# EAGLE design v13 (EAGLE 7.2.0)
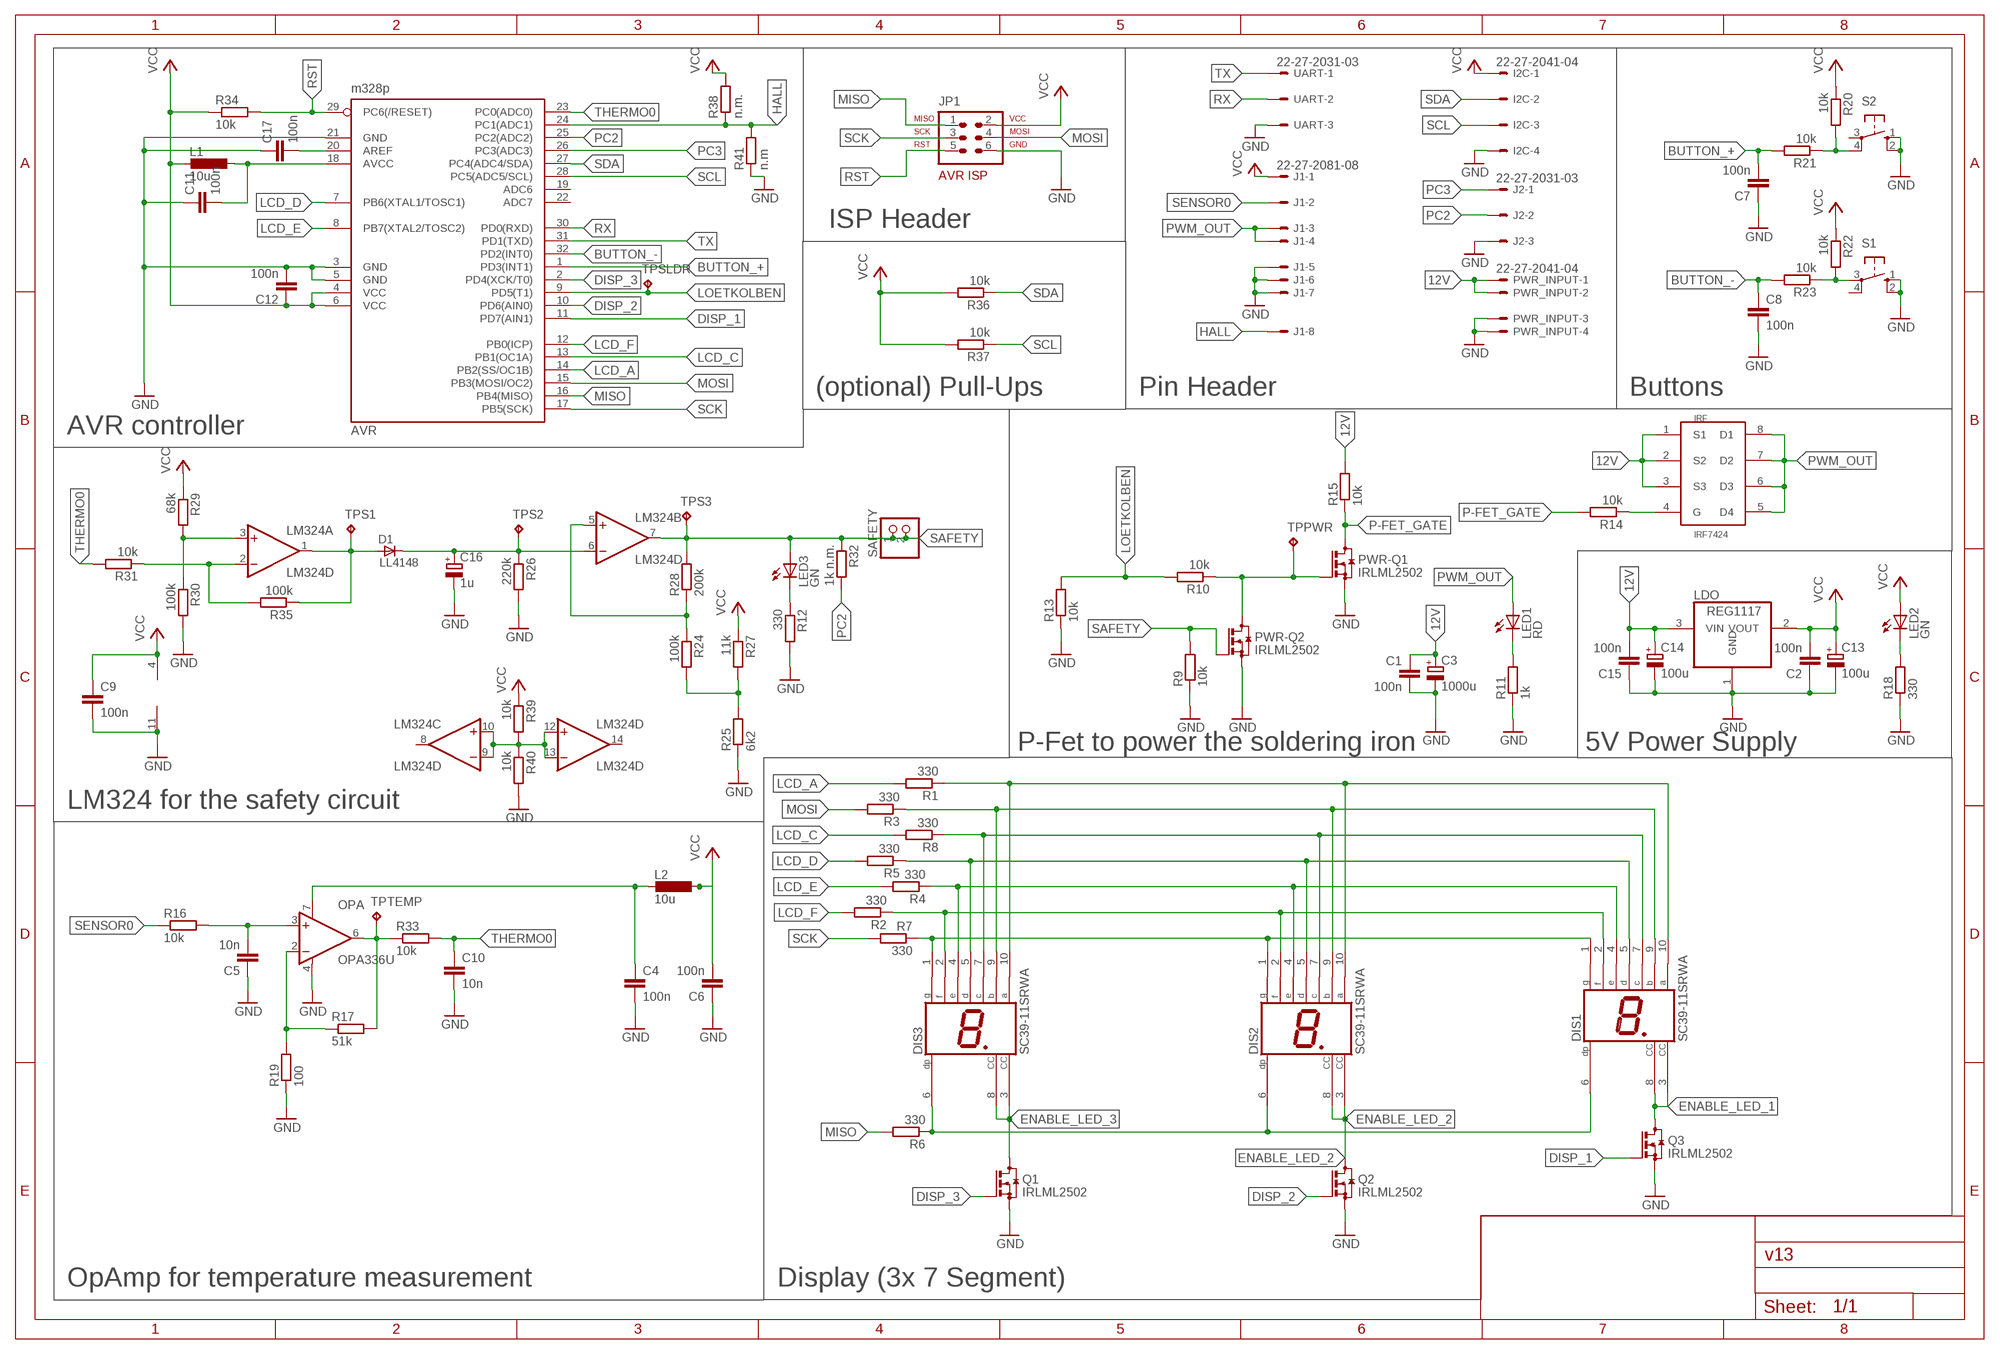
[diagram p0: schematic, sheet 1]

## Parts
AVR  m328p  MEGA8-AI  [TQFP32-08]
C1  100n  C-EUC0603  [C0603]
C2  100n  C-EUC0603  [C0603]
C3  1000u  CPOL-EUE5-13  [E5-13]
C4  100n  C-EUC0603  [C0603]
C5  10n  C-EUC0603  [C0603]
C6  100n  C-EUC0603  [C0603]
C7  100n  C-EUC0603  [C0603]
C8  100n  C-EUC0603  [C0603]
C9  100n  C-EUC0603  [C0603]
C10  10n  C-EUC0603  [C0603]
C11  100n  C-EUC0603  [C0603]
C12  100n  C-EUC0603  [C0603]
C13  100u  CPOL-EUE2-5  [E2-5]
C14  100u  CPOL-EUE2-5  [E2-5]
C15  100n  C-EUC0603  [C0603]
C16  1u  CPOL-EUE2-5  [E2-5]
C17  100n  C-EUC0603  [C0603]
D1  LL4148  [SOD80_DO213AA_MINIMELF]
DIS1  SC39-11SRWA  [HDSP-E]
DIS2  SC39-11SRWA  [HDSP-E]
DIS3  SC39-11SRWA  [HDSP-E]
I2C  22-27-2041-04  [6410-04]
IRF  IRF7424  [SO-08]
J1  22-27-2081-08  [6410-08]
J2  22-27-2031-03  [6410-03]
JP1  AVR-ISP-6VERT  [AVR-ISP-6]
L1  10u  L-EUL2825P  [L2825P]
L2  10u  L-EUL2825P  [L2825P]
LDO  REG1117  [SOT223]
LED1  RD  LEDCHIP-LED0805  [CHIP-LED0805]
LED2  GN  LEDCHIP-LED0805  [CHIP-LED0805]
LED3  GN  LEDCHIP-LED0805  [CHIP-LED0805]
LM324  LM324D  [SO14]
OPA  OPA336U  [SO08]
PWR-Q1  IRLML2502  BSS123  [SOT23]
PWR-Q2  IRLML2502  BSS123  [SOT23]
PWR_INPUT  22-27-2041-04  [6410-04]
Q1  IRLML2502  BSS123  [SOT23]
Q2  IRLML2502  BSS123  [SOT23]
Q3  IRLML2502  BSS123  [SOT23]
R1  330  R-EU_R0603  [R0603]
R2  330  R-EU_R0603  [R0603]
R3  330  R-EU_R0603  [R0603]
R4  330  R-EU_R0603  [R0603]
R5  330  R-EU_R0603  [R0603]
R6  330  R-EU_R0603  [R0603]
R7  330  R-EU_R0603  [R0603]
R8  330  R-EU_R0603  [R0603]
R9  10k  R-EU_R0603  [R0603]
R10  10k  R-EU_R0603  [R0603]
R11  1k  R-EU_R0603  [R0603]
R12  330  R-EU_R0603  [R0603]
R13  10k  R-EU_R0603  [R0603]
R14  10k  R-EU_R0603  [R0603]
R15  10k  R-EU_R0603  [R0603]
R16  10k  R-EU_R0603  [R0603]
R17  51k  R-EU_R0603  [R0603]
R18  330  R-EU_R0603  [R0603]
R19  100  R-EU_R0603  [R0603]
R20  10k  R-EU_R0603  [R0603]
R21  10k  R-EU_R0603  [R0603]
R22  10k  R-EU_R0603  [R0603]
R23  10k  R-EU_R0603  [R0603]
R24  100k  R-EU_R0603  [R0603]
R25  6k2  R-EU_R0603  [R0603]
R26  220k  R-EU_R0603  [R0603]
R27  11k  R-EU_R0603  [R0603]
R28  200k  R-EU_R0603  [R0603]
R29  68k  R-EU_R0603  [R0603]
R30  100k  R-EU_R0603  [R0603]
R31  10k  R-EU_R0603  [R0603]
R32  1k n.m.  R-EU_R0603  [R0603]
R33  10k  R-EU_R0603  [R0603]
R34  10k  R-EU_R0603  [R0603]
R35  100k  R-EU_R0603  [R0603]
R36  10k  R-EU_R0603  [R0603]
R37  10k  R-EU_R0603  [R0603]
R38  n.m.  R-EU_R0603  [R0603]
R39  10k  R-EU_R0603  [R0603]
R40  10k  R-EU_R0603  [R0603]
R41  n.m  R-EU_R0603  [R0603]
S1  10-XX  [B3F-10XX]
S2  10-XX  [B3F-10XX]
SAFETY  PINHD-1X2  [1X02]
TPPWR  TPB1,27  [B1,27]
TPS1  TPB1,27  [B1,27]
TPS2  TPB1,27  [B1,27]
TPS3  TPB1,27  [B1,27]
TPSLDR  TPB1,27  [B1,27]
TPTEMP  TPB1,27  [B1,27]
UART  22-27-2031-03  [6410-03]

## Nets
12V: C1.1 C3.+ C14.+ C15.2 IRF.1(S1) IRF.2(S2) IRF.3(S3) LDO.3(VIN) PWR_INPUT.1 PWR_INPUT.2 R15.2
AREF: AVR.20(AREF) C17.2
AVCC: AVR.18(AVCC) C11.2 L1.1
BUTTON_+: AVR.1(PD3(INT1)) C7.2 R21.2
BUTTON_-: AVR.32(PD2(INT0)) C8.1 R23.2
DISP_1: AVR.11(PD7(AIN1)) Q3.1(G)
DISP_2: AVR.10(PD6(AIN0)) Q2.1(G)
DISP_3: AVR.2(PD4(XCK/T0)) Q1.1(G)
ENABLE_LED_1: DIS1.3(CC) DIS1.8(CC) Q3.3(D)
ENABLE_LED_2: DIS2.3(CC) DIS2.8(CC) Q2.3(D)
ENABLE_LED_3: DIS3.3(CC) DIS3.8(CC) Q1.3(D)
GND: AVR.3(GND) AVR.5(GND) AVR.21(GND) C1.2 C2.1 C3.- C4.2 C5.1 C6.1 C7.1 C8.2 C9.2 C10.2 C11.1 C12.2 C13.- C14.- C15.1 C16.- C17.1 I2C.4 J1.5 J1.6 J1.7 J2.3 JP1.6 LDO.1(GND) LM324.11(P:V-) OPA.4(V-) PWR-Q1.2(S) PWR-Q2.2(S) PWR_INPUT.3 PWR_INPUT.4 Q1.2(S) Q2.2(S) Q3.2(S) R9.1 R11.1 R12.2 R13.1 R18.1 R19.1 R25.1 R26.2 R30.2 R40.2 R41.1 S1.1(S) S1.2(S1) S2.1(S) S2.2(S1) UART.3
HALL: AVR.24(PC1(ADC1)) J1.8 R38.1 R41.2
LCD_A: AVR.14(PB2(SS/OC1B)) R1.2
LCD_C: AVR.13(PB1(OC1A)) R8.2
LCD_D: AVR.7(PB6(XTAL1/TOSC1)) R5.2
LCD_E: AVR.8(PB7(XTAL2/TOSC2)) R4.2
LCD_F: AVR.12(PB0(ICP)) R2.2
LOETKOLBEN: AVR.9(PD5(T1)) R10.2 R13.2 TPSLDR.TP
MISO: AVR.16(PB4(MISO)) JP1.1 R6.2
MOSI: AVR.15(PB3(MOSI/OC2)) JP1.4 R3.2
N$1: OPA.2(-IN) R17.1 R19.2
N$2: LED3.C R12.1
N$3: LM324.2(A:-IN) R31.1 R35.2
N$4: LM324.9(C:-IN) LM324.10(C:+IN) LM324.12(D:+IN) LM324.13(D:-IN) R39.2 R40.1
N$5: C4.1 L2.2 OPA.7(V+)
N$7: D1.A LM324.1(A:OUT) R35.1 TPS1.TP
N$8: LM324.3(A:+IN) R29.2 R30.1
N$11: C16.+ D1.C LM324.6(B:-IN) R26.1 TPS2.TP
N$12: LM324.5(B:+IN) R24.1 R28.1
N$14: R24.2 R25.2 R27.2
N$15: IRF.4(G) R14.1
N$16: PWR-Q1.1(G) PWR-Q2.3(D) R10.1 TPPWR.TP
N$22: R22.2 R23.1 S1.3(P)
N$23: R20.2 R21.1 S2.4(P1)
N$24: LED2.C R18.2
N$25: LED1.C R11.2
N$27: C5.2 OPA.3(+IN) R16.2
N$31: DIS1.6(DP) DIS2.6(DP) DIS3.6(DP) R6.1
N$34: DIS1.2(F) DIS2.2(F) DIS3.2(F) R2.1
N$35: DIS1.1(G) DIS2.1(G) DIS3.1(G) R7.1
N$36: DIS1.4(E) DIS2.4(E) DIS3.4(E) R4.1
N$37: DIS1.5(D) DIS2.5(D) DIS3.5(D) R5.1
N$38: DIS1.7(C) DIS2.7(C) DIS3.7(C) R8.1
N$39: DIS1.9(B) DIS2.9(B) DIS3.9(B) R3.1
N$40: DIS1.10(A) DIS2.10(A) DIS3.10(A) R1.1
OPA_OUT: OPA.6(OUT) R17.2 R33.1 TPTEMP.TP
P-FET_GATE: PWR-Q1.3(D) R14.2 R15.1
PC2: AVR.25(PC2(ADC2)) J2.2 R32.2
PC3: AVR.26(PC3(ADC3)) J2.1
PWM_OUT: IRF.5(D4) IRF.6(D3) IRF.7(D2) IRF.8(D1) J1.3 J1.4 LED1.A
RST: AVR.29(PC6(/RESET)) JP1.5 R34.2
RX: AVR.30(PD0(RXD)) UART.2
SAFETY: LED3.A LM324.7(B:OUT) PWR-Q2.1(G) R9.2 R28.2 R32.1 SAFETY.1 SAFETY.2 TPS3.TP
SCK: AVR.17(PB5(SCK)) JP1.3 R7.2
SCL: AVR.28(PC5(ADC5/SCL)) I2C.3 R37.1
SDA: AVR.27(PC4(ADC4/SDA)) I2C.2 R36.1
SENSOR0: J1.2 R16.1
THERMO0: AVR.23(PC0(ADC0)) C10.1 R31.2 R33.2
TX: AVR.31(PD1(TXD)) UART.1
VCC: AVR.4(VCC) AVR.6(VCC) C2.2 C6.2 C9.1 C12.1 C13.+ I2C.1 J1.1 JP1.2 L1.2 L2.1 LDO.2(VOUT) LED2.A LM324.4(P:V+) R20.1 R22.1 R27.1 R29.1 R34.1 R36.2 R37.2 R38.2 R39.1
Unconnected: AVR.19(ADC6) AVR.22(ADC7) LM324.8(C:OUT) LM324.14(D:OUT) S1.4(P1) S2.3(P)

## Notes on the sheet
- ISP Header
- (optional) Pull-Ups | Pin Header | Buttons
- AVR controller
- P-Fet to power the soldering iron | 5V Power Supply
- LM324 for the safety circuit
- OpAmp for temperature measurement | Display (3x 7 Segment)

## Library data of the parts
AVR = atmel:MEGA8: MICROCONTROLLER 8 Kbytes FLASH, 1 kbytes SRAM, 512 bytes EEPROM, USART, 6-channel 10 bit ADC, 2-channel 8 bit ADC Pin compatible with Atmega48, ATMega88, ATMega168 Source: avr.lbr; MPN: ATMEGA8-16AU; OC_FARNELL: 9171371; OC_NEWARK: 73M8863
C1 C2 C4-C12 C15 C17 = rcl:C-EU: CAPACITOR, European symbol
C3 C13 C14 C16 = rcl:CPOL-EU: POLARIZED CAPACITOR, European symbol
D1 = _hhn_diodes_smd:LL4148: 1N4148 General Purpose Rectifie SMD-Version of 1N4148 Case: SOD 80 = DO 213 AA = MINIMELF (Glass) Author: Dipl.-Ing. FH Rainer Bayer HHN Hochschule Heilbronn, rainer.bayer@hs-heilbronn.de Ingenieurbüro ing-rb, mail@ing-rb.de
DIS1-DIS3 = display-hp:SC39-11SRWA: SINGLE DIGIT NUMERIC DISPLAY 9.9mm (0.39INCH) Source: SC39-11SRWA.pdf; OC_FARNELL: unknown; OC_NEWARK: unknown
I2C PWR_INPUT = con-molex:22-?-04: CONNECTOR wire to board 2.54 mm (.1 inch) pitch header; OC_FARNELL: unknown; OC_NEWARK: unknown
IRF = MyLib:IRF7424
J1 = con-molex:22-?-08: CONNECTOR wire to board 2.54 mm (.1 inch) pitch header; OC_FARNELL: unknown; OC_NEWARK: unknown
J2 UART = con-molex:22-?-03: CONNECTOR wire to board 2.54 mm (.1 inch) pitch header; OC_FARNELL: unknown; OC_NEWARK: unknown
JP1 = avr-7:AVR-ISP-6: AVR ISP-6 Serial Programming Header
L1 L2 = rcl:L-EU: INDUCTOR, European symbol
LDO = burr-brown:REG1117: 800mA and 1A Low Dropout (LDO) Positive Regulator 1.8V, 2.5V, 2.85V, 3.3V, 5V, and Adj; MPN: REG1117; OC_FARNELL: 1097566; OC_NEWARK: 14P6981
LED1-LED3 = led:LED: LED OSRAM: - CHIPLED LG R971, LG N971, LY N971, LG Q971, LY Q971, LO R971, LY R971 LH N974, LH R974 LS Q976, LO Q976, LY Q976 LO Q996 - Hyper CHIPLED LW Q18S LB Q993, LB Q99A, LB R99A - SideLED LS A670, LO A670, LY A670, LG A670, LP A670 LB A673, LV A673, LT A673, LW A673 LH A674 LY A675 LS A676, LA A676, LO A676, LY A676, LW A676 LS A679, LY A679, LG A679 - Hyper Micro SIDELED® LS Y876, LA Y876, LO Y876, LY Y876 LT Y87S - SmartLED LW L88C, LW L88S LB L89C, LB L89S, LG L890 LS L89K, LO L89K, LY L89K LS L896, LA L896, LO L896, LY L896 - TOPLED LS T670, LO T670, LY T670, LG T670, LP T670 LSG T670, LSP T670, LSY T670, LOP T670, LYG T670 LG T671, LOG T671, LSG T671 LB T673, LV T673, LT T673, LW T673 LH T674 LS T676, LA T676, LO T676, LY T676, LB T676, LH T676, LSB T676, LW T676 LB T67C, LV T67C, LT T67C, LS T67K, LO T67K, LY T67K, LW E67C LS E67B, LA E67B, LO E67B, LY E67B, LB E67C, LV E67C, LT E67C LW T67C LS T679, LY T679, LG T679 LS T770, LO T770, LY T770, LG T770, LP T770 LB T773, LV T773, LT T773, LW T773 LH T774 LS E675, LA E675, LY E675, LS T675 LS T776, LA T776, LO T776, LY T776, LB T776 LHGB T686 LT T68C, LB T68C - Hyper Mini TOPLED® LB M676 - Mini TOPLED Santana® LG M470 LS M47K, LO M47K, LY M47K Source: http://www.osram.convergy.de LUXEON: - LUMILED® LXK2-PW12-R00, LXK2-PW12-S00, LXK2-PW14-U00, LXK2-PW14-V00 LXK2-PM12-R00, LXK2-PM12-S00, LXK2-PM14-U00 LXK2-PE12-Q00, LXK2-PE12-R00, LXK2-PE12-S00, LXK2-PE14-T00, LXK2-PE14-U00 LXK2-PB12-K00, LXK2-PB12-L00, LXK2-PB12-M00, LXK2-PB14-N00, LXK2-PB14-P00, LXK2-PB14-Q00 LXK2-PR12-L00, LXK2-PR12-M00, LXK2-PR14-Q00, LXK2-PR14-R00 LXK2-PD12-Q00, LXK2-PD12-R00, LXK2-PD12-S00 LXK2-PH12-R00, LXK2-PH12-S00 LXK2-PL12-P00, LXK2-PL12-Q00, LXK2-PL12-R00 Source: www.luxeon.com KINGBRIGHT: KA-3528ASYC Source: www.kingbright.com
LM324 = linear:LM324: OP AMP
OPA = burr-brown:OPA336: CMOS Operational Amplifiers Single-Supply, MicroPower, MicroAmplifier(TM) Series; MF: TEXAS INSTRUMENT CONNECTORS; MPN: OPA336UA; OC_FARNELL: 1459587; OC_NEWARK: 35C1888
PWR-Q1 PWR-Q2 Q1-Q3 = transistor-small-signal:BSS123: N-CHANNEL MOS FET
R1-R41 = rcl:R-EU_: RESISTOR, European symbol
S1 S2 = switch-omron:10-XX: OMRON SWITCH; MPN: B3F-1000; OC_FARNELL: 176432; OC_NEWARK: 36M3542
SAFETY = pinhead:PINHD-1X2: PIN HEADER
TPPWR TPS1-TPS3 TPSLDR TPTEMP = testpad:TP: Test pad

## Board
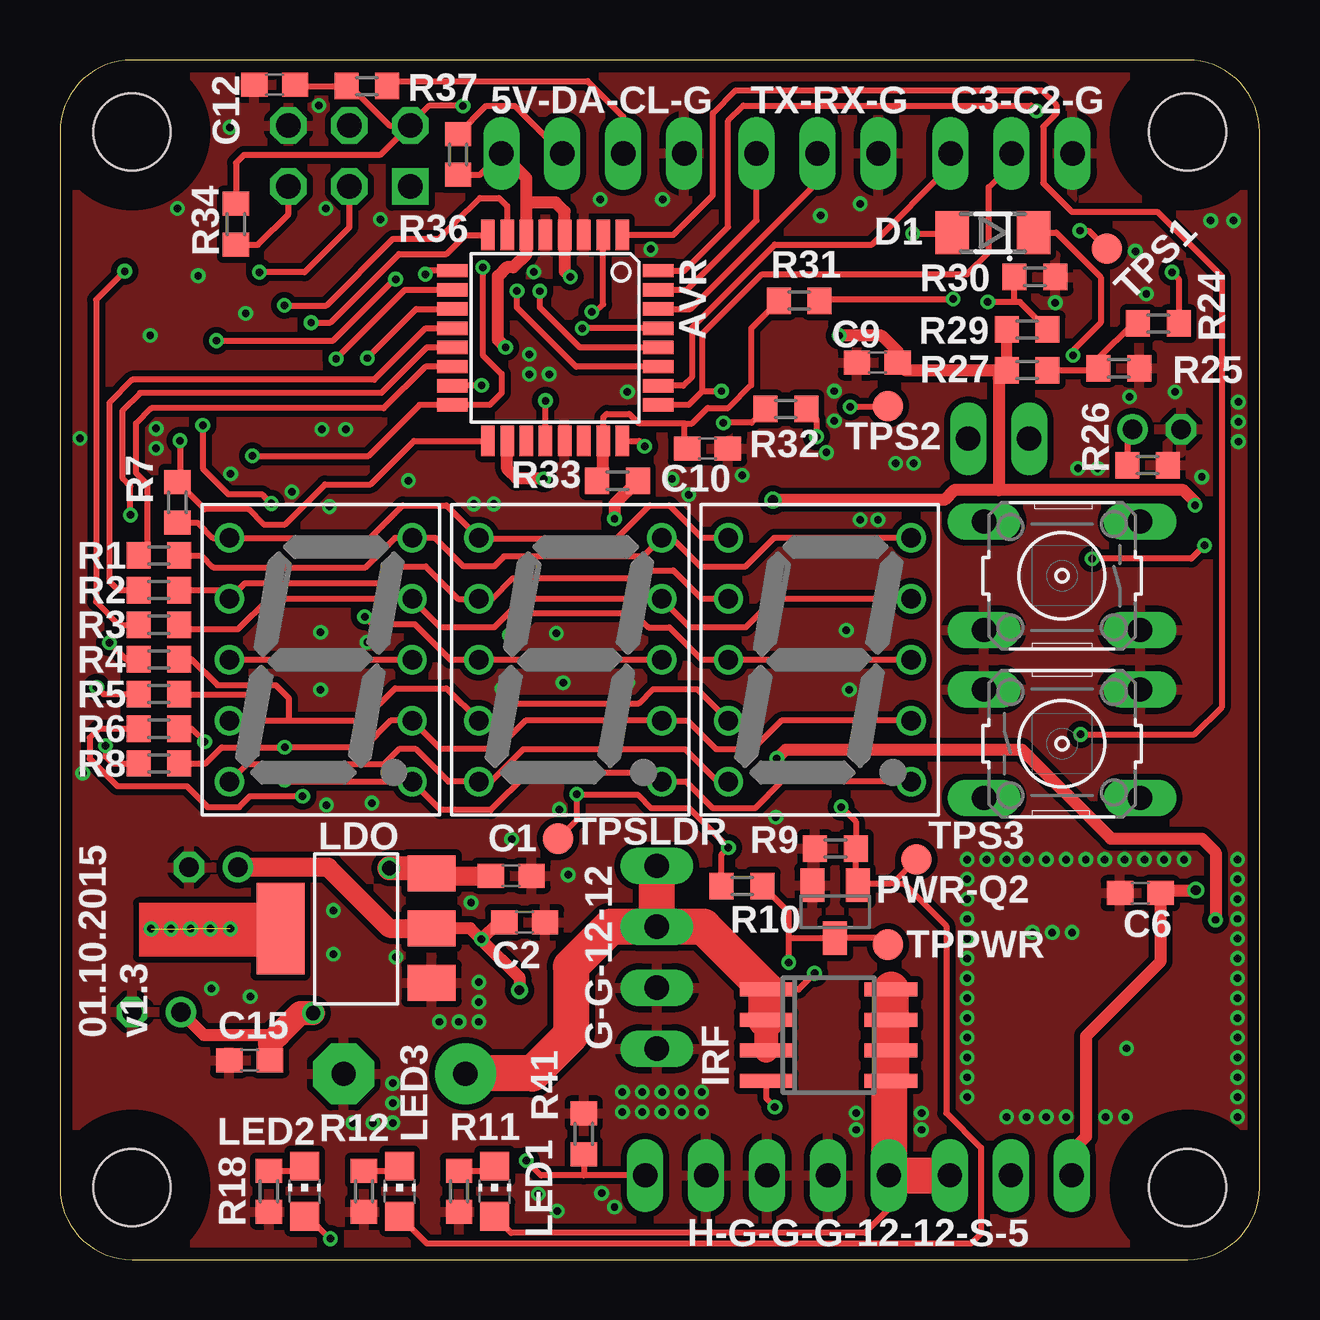
[diagram p1: board, top side]
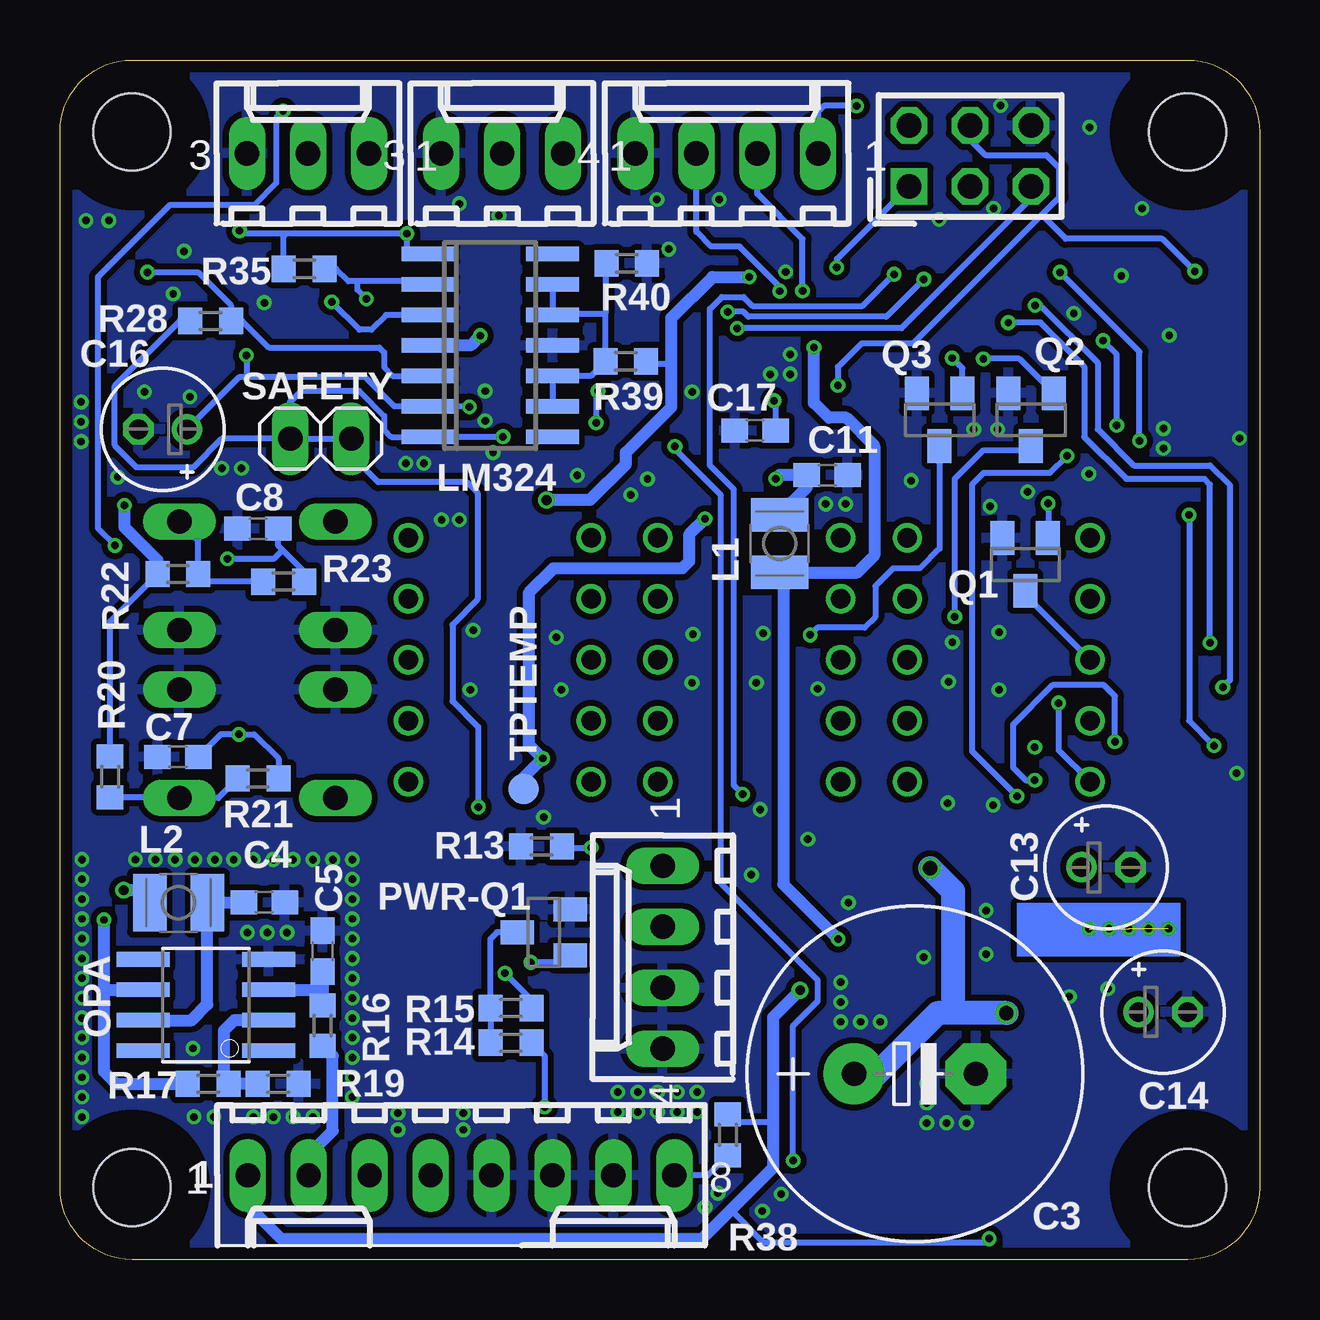
[diagram p2: board, bottom side, seen from below]

Size 50 x 50 mm. Coordinates in mm from the lower left corner, seen from the top.
Outline: 3,0 47,0 arc90 50,3 50,47 arc90 47,50 3,50 arc90 0,47 0,3 arc90 3,0
Copper layers (1*2*15*16): Top 0.035mm / dielectric 0.2mm / layer 2 0.035mm / dielectric 1.2mm / layer 15 0.035mm / dielectric 0.2mm / Bottom 0.035mm
Design rules "Elecrow_PCB_eagle_rule *": minimum track width 6mil, minimum drill 12mil, track to track 6mil, track to pad 8mil, pad to pad 12mil, via to via 6mil, smd to smd 0mil, copper to edge 20mil, drill to drill 10mil, minimum pad ring 6mil, minimum via ring 6mil, stop-mask expansion 0mil, vias tented up to drill 100mil, thermal gap 10mil
Holes 3.2 mm at 47,47 3,47 47,3 3,3
tRestrict: area 0,0 to 6,6; area 44,0 to 50,6; area 44,44 to 50,50; area 0,44 to 6,50
bRestrict: area 0,0 to 6,6; area 0,44 to 6,50; area 44,44 to 50,50; area 44,0 to 50,6

### Footprints (pad centres in the part's own frame; a part is rotated, then mirrored left to right if it is on the bottom)
TQFP32-08 = smd 1.27 x 0.559: 1 -4.293,2.8; 2 -4.293,2; 3 -4.293,1.2; 4 -4.293,0.4; 5 -4.293,-0.4; 6 -4.293,-1.2; 7 -4.293,-2; 8 -4.293,-2.8; 17 4.293,-2.8; 18 4.293,-2; 19 4.293,-1.2; 20 4.293,-0.4; 21 4.293,0.4; 22 4.293,1.2; 23 4.293,2; 24 4.293,2.8 | smd 0.559 x 1.27: 9 -2.8,-4.293; 10 -2,-4.293; 11 -1.2,-4.293; 12 -0.4,-4.293; 13 0.4,-4.293; 14 1.2,-4.293; 15 2,-4.293; 16 2.8,-4.293; 25 2.8,4.293; 26 2,4.293; 27 1.2,4.293; 28 0.4,4.293; 29 -0.4,4.293; 30 -1.2,4.293; 31 -2,4.293; 32 -2.8,4.293
C0603 = smd 1.1 x 1: 1 -0.85,0; 2 0.85,0
E5-13 = drill 1.016 pad 2.54: + -2.54,0 | drill 1.016 pad 2.54 octagon: - 2.54,0
E2-5 = drill 0.813 pad 1.27: + -1.016,0 | drill 0.813 pad 1.27 octagon: - 1.016,0
SOD80_DO213AA_MINIMELF = smd 1.4 x 1.8: A 1.7,0; C -1.7,0
HDSP-E = drill 0.813: 1 -3.81,5.08; 2 -3.81,2.54; 3 -3.81,0; 4 -3.81,-2.54; 5 -3.81,-5.08; 6 3.81,-5.08; 7 3.81,-2.54; 8 3.81,0; 9 3.81,2.54; 10 3.81,5.08
6410-04 = drill 1.016 long: 1 3.81,0; 2 1.27,0; 3 -1.27,0; 4 -3.81,0
SO-08 = smd 0.6 x 2.2: 1 -1.905,-2.6; 2 -0.635,-2.6; 3 0.635,-2.6; 4 1.905,-2.6; 5 1.905,2.6; 6 0.635,2.6; 7 -0.635,2.6; 8 -1.905,2.6
6410-08 = drill 1.016 long: 1 8.89,0; 2 6.35,0; 3 3.81,0; 4 1.27,0; 5 -1.27,0; 6 -3.81,0; 7 -6.35,0; 8 -8.89,0
6410-03 = drill 1.016 long: 1 2.54,0; 2 0,0; 3 -2.54,0
AVR-ISP-6 = drill 1.016 square: 1 -2.54,-1.27 | drill 1.016 octagon: 2 -2.54,1.27; 3 0,-1.27; 4 0,1.27; 5 2.54,-1.27; 6 2.54,1.27
L2825P = smd 1.4 x 2.4: 1 -1.2,0; 2 1.2,0
SOT223 = smd 1.499 x 2.007: 1 -2.261,-3.15; 2 0.025,-3.15; 3 2.311,-3.15 | smd 3.81 x 2.007: 4 0,3.15
CHIP-LED0805 = smd 1.2 x 1.2: A 0,-1.05; C 0,1.05
SO14 = smd 0.6 x 2.2: 1 -3.81,-2.6; 2 -2.54,-2.6; 3 -1.27,-2.6; 4 0,-2.6; 5 1.27,-2.6; 6 2.54,-2.6; 7 3.81,-2.6; 8 3.81,2.6; 9 2.54,2.6; 10 1.27,2.6; 11 0,2.6; 12 -1.27,2.6; 13 -2.54,2.6; 14 -3.81,2.6
SO08 = smd 0.61 x 2.21: 1 -1.905,-2.616; 2 -0.635,-2.616; 3 0.635,-2.616; 4 1.905,-2.616; 5 1.905,2.616; 6 0.635,2.616; 7 -0.635,2.616; 8 -1.905,2.616
SOT23 = smd 1 x 1.4: 1 -0.95,-1.1; 2 0.95,-1.1; 3 0,1.1
R0603 = smd 1 x 1.1: 1 -0.85,0; 2 0.85,0
B3F-10XX = drill 1.016 long: 1 -3.251,2.261; 2 3.251,2.261; 3 -3.251,-2.261; 4 3.251,-2.261
1X02 = drill 1.016 long: 1 -1.27,0; 2 1.27,0
B1,27 = smd 1.27 x 1.27: TP 0,0

### Placement (x,y rotation side)
AVR  20.64,38.42 270 top
C1  18.81,15.99 0 top
C2  19.37,14.06 180 top
C3  14.36,7.74 0 bottom
C4  41.48,14.89 0 bottom
C5  39.06,12.86 270 bottom
C6  45.03,15.27 0 top
C7  45.09,20.95 0 bottom
C8  41.75,30.47 180 bottom
C9  34.07,37.39 180 top
C10  26.99,33.79 0 top
C11  18.02,32.7 180 bottom
C12  8.95,48.97 180 top
C13  6.4,16.34 0 bottom
C14  4.02,10.32 0 bottom
C15  7.91,8.3 0 top
C16  45.72,34.61 180 bottom
C17  21.02,34.55 0 bottom
D1  38.88,42.8 180 top
DIS1  31.67,25 0 top
DIS2  21.27,25 0 top
DIS3  10.87,25 0 top
I2C  22.21,46.1 0 bottom
IRF  32.04,9.35 270 top
J1  33.28,3.51 180 bottom
J2  39.66,46.1 0 bottom
JP1  12.06,46 0 bottom
L1  20,29.84 270 bottom
L2  45.06,14.87 0 bottom
LDO  12.34,13.79 90 top
LED1  18.12,2.85 0 top
LED2  10.19,2.85 0 top
LED3  14.16,2.85 0 top
LM324  32.07,38.1 270 bottom
OPA  43.92,10.61 90 bottom
PWR-Q1  29.83,13.64 90 bottom
PWR-Q2  32.31,14.5 180 top
PWR_INPUT  24.88,12.6 90 bottom
Q1  9.76,28.97 180 bottom
Q2  9.53,35 180 bottom
Q3  13.34,35 180 bottom
R1  4.13,29.35 180 top
R2  4.13,27.9 180 top
R3  4.13,26.46 180 top
R4  4.13,25.01 180 top
R5  4.13,23.57 180 top
R6  4.13,22.12 180 top
R7  4.9,31.57 90 top
R8  4.13,20.68 180 top
R9  32.32,17.13 0 top
R10  28.43,15.57 180 top
R11  16.63,2.85 90 top
R12  12.67,2.85 270 top
R13  29.93,17.22 0 bottom
R14  31.2,9.04 180 bottom
R15  31.2,10.48 0 bottom
R16  39.05,9.75 90 bottom
R17  43.82,7.32 180 bottom
R18  8.71,2.85 90 top
R19  40.91,7.32 180 bottom
R20  47.91,20.12 270 bottom
R21  41.74,20.05 0 bottom
R22  45.09,28.57 0 bottom
R23  40.67,28.26 0 bottom
R24  45.78,39.01 180 top
R25  44.13,37.15 180 top
R26  45.34,33.11 0 top
R27  40.31,37.06 0 top
R28  43.72,39.12 180 bottom
R29  40.31,38.76 0 top
R30  40.64,40.96 0 top
R31  30.82,39.96 180 top
R32  30.25,35.46 180 top
R33  23.24,32.46 180 top
R34  7.33,43.15 270 top
R35  39.82,41.29 0 bottom
R36  16.59,46.06 270 top
R37  12.8,48.91 180 top
R38  22.16,5.2 90 bottom
R39  26.42,37.44 180 bottom
R40  26.37,41.52 0 bottom
R41  21.83,5.24 270 top
S1  41.77,28.5 180 top
S2  41.77,21.5 0 top
SAFETY  39.13,34.22 0 bottom
TPPWR  34.51,13.13 0 top
TPS1  43.63,42.14 0 top
TPS2  34.51,35.58 0 top
TPS3  35.7,16.68 0 top
TPSLDR  20.76,17.54 0 top
TPTEMP  30.67,19.61 0 bottom
UART  31.57,46.1 0 bottom

### Tracks (layer width: path | path; a pad name or v marks a point on that pad's centre or on a via)
12V  (via drill 0.31, 0.6)
  Top 0.254: v31.45,11.93 30.78,11.26 IRF.1 | 17.87,16.08 C1.1
  Top 0.5: C14.+ 6,9.36 9.1,9.36 | LDO.3 15.6,15.99
  Top 0.8: 15.6,15.99 C1.1 | LDO.3 15.38,16.21 15.38,16.31
  Top 1: 15.38,16.31 v13.73,16.31 | v10.55,10.28 10.02,10.28 9.1,9.36 8.76,9.02 C15.2 | IRF.2 IRF.3
  Top 1.5: 29.43,11.27 IRF.1 | IRF.1 IRF.2 | IRF.1 26.83,13.87 PWR_INPUT.2 | PWR_INPUT.2 PWR_INPUT.1 | PWR_INPUT.2 22.95,13.87 21.3,12.22 21.3,9.37 19.69,7.76 16.92,7.76 C3.+
  Bottom 0.254: R15.2 30.35,10.83 v31.45,11.93
  Bottom 0.5: 12.77,10.91 13.41,10.28
  Bottom 1: v13.73,16.31 12.77,15.36 12.77,10.91 | v10.55,10.28 13.41,10.28 15.95,7.74 C3.+
AREF  (via drill 0.31)
  Top 0.254: AVR.20 v20.24,35.8
  Bottom 0.254: v20.24,35.8 20.18,35.73 C17.2
AVCC  (via drill 0.31)
  Top 0.5: v20.16,32.54 19.05,32.54 18.64,32.96 AVR.18
  Bottom 0.254: C11.2 18.87,32.18
  Bottom 0.5: 18.87,32.18 L1.1 | C11.2 20,32.7 v20.16,32.54
BUTTON_+  (via drill 0.31)
  Top 0.254: AVR.1 25.57,42.71 27.21,44.35 27.21,47.78 28.16,48.74 40.91,48.74 41.52,48.13 41.52,47.76 40.99,47.22 40.99,44.87 42.18,43.67 45.73,43.67 48.42,40.98 48.42,23.02 47.29,21.89 v42.55,21.89
  Bottom 0.254: R21.2 40.9,20.88 41.91,21.89 v42.55,21.89 43.3,21.89 C7.2
BUTTON_-  (via drill 0.31)
  Top 0.254: v47.71,29.76 47.16,29.21 v43.02,29.21 | v40.7,47.88 40.48,48.1 28.48,48.1 27.84,47.47 27.84,43.03 26.03,41.22 AVR.32
  Bottom 0.254: 40.72,29.57 40.9,29.75 C8.1 | 40.72,29.57 39.83,28.68 R23.2 | v47.71,29.76 48.42,30.47 48.42,40.96 45.42,43.96 41.89,43.96 40.99,44.87 40.99,47.59 v40.7,47.88 | v43.02,29.21 41.08,29.21 40.72,29.57
DISP_1  (via drill 0.31)
  Top 0.254: v12.81,37.57 14.85,39.62 AVR.11
  Bottom 0.254: Q3.1 12.38,37.15 v12.81,37.57
DISP_2  (via drill 0.31)
  Top 0.254: v11.51,37.54 14.38,40.42 AVR.10
  Bottom 0.254: Q2.1 10.02,37.54 v11.51,37.54
DISP_3  (via drill 0.31)
  Top 0.254: 8.49,31.83 v8.81,31.51 8.42,31.91 7.02,31.91 5.95,32.97 v5.95,34.77 | v6.52,38.3 11.39,38.3 13.95,40.86 v13.99,40.86 | AVR.2 22.64,39.81 22.33,39.5 v22.16,39.5
  Bottom 0.254: v8.81,31.51 Q1.1 | v5.95,34.77 5.95,37.73 v6.52,38.3 | v13.99,40.86 15.56,39.29 21.3,39.29 21.5,39.5 v22.16,39.5
ENABLE_LED_1  (via drill 0.31)
  Top 0.254: DIS1.8 DIS1.3 26.75,25 25.4,26.35 24.54,26.35 23.94,26.95 19.65,26.95 v18.73,26.04
  Bottom 0.254: Q3.3 13.34,29.63 14.16,28.81 15.27,28.81 16.02,28.07 16.02,26.79 16.47,26.33 18.43,26.33 v18.73,26.04
ENABLE_LED_2  (via drill 0.31)
  Top 0.254: DIS2.8 DIS2.3 16.27,25 14.8,26.48 13.02,26.48 v12.7,26.79
  Bottom 0.254: v12.7,26.79 12.7,32.54 11.51,33.73 9.7,33.73 Q2.3
ENABLE_LED_3
  Top 0.254: DIS3.8 DIS3.3
  Bottom 0.254: Q1.3 9.76,27.7 DIS3.3
GND  (via drill 0.31)
  other vias: 42.43,32.98 19.56,36.9 17.25,31.49 14.53,32.46 11.23,31.39 7.11,32.75 10.92,34.61 9.67,32 22.52,44.18 43.26,32.98 44.58,35.96 44.83,42.03 33.35,44.01 31.7,43.51 23.65,36.17 25.51,32.53 28.44,32.69 31.95,33.64 4.01,33.81 0.83,34.23 3.76,38.52 0.95,20.28 13.35,43.36 11.08,43.81 5.76,41.01 37.81,11.72 49.08,10.07 10.86,26.15 10.86,23.75 11.1,18.95 37.81,10.9 37.81,10.07 37.81,9.25 37.81,8.42 37.81,7.59 37.81,6.77 37.81,12.55 37.81,13.37 44.46,8.8 29.84,18.44 37.81,14.2 39.46,16.68 40.28,16.68 41.11,16.68 41.94,16.68 42.76,16.68 32.28,36.2 32.28,34.96 49.08,10.9 49.08,11.72 49.08,12.55 49.08,13.37 49.08,14.2 46.02,16.68 46.85,16.68 43.55,16.68 45.2,16.68 44.37,16.68 49.08,9.25 49.08,8.42 49.08,7.59 49.08,6.77 49.08,5.94 39.46,5.94 40.28,5.94 41.11,5.94 41.94,5.94 43.59,5.94 44.41,5.94 17.46,9.91 16.63,9.91 15.81,9.91 17.46,11.56 17.46,10.73 40.54,13.63 41.36,13.63 42.19,13.63 23.44,6.98 24.27,6.98 25.1,6.98 25.92,6.98 26.75,6.98 23.44,6.15 24.27,6.15 25.1,6.15 25.92,6.15 26.75,6.15 33.19,5.41 35.91,5.41 33.19,6.11 35.91,6.11 26.21,31.87 18.83,17.52 21.18,16.03 11.4,14.55 11.4,12.73 20.97,24.04 18.41,23.79 23.66,24.04 25.12,44.18 10.79,48.1 7.08,47.2 4.89,43.81 13.87,5.7 13.04,5.7 12.22,5.7 13.87,7.35 13.87,6.52 11.91,34.61 20.39,36.9 19.56,37.73 7.74,39.44 47.96,43.31 48.91,43.31 45.28,40.25 17.14,14.88 14,12.61 7.93,10.96 6.32,11.29 4.01,34.64 34.09,30.83 34.84,33.19 41.48,39.88 46.48,36.17 49.12,35.74 49.12,34.92 49.12,34.09 35.58,33.19 18.08,31.49 29.11,23.75 32.9,23.75 29.31,25.94 32.78,26.23 20.69,26.1 23.62,26.06 12.8,25.73 12.97,24.08 33.35,30.83 24.62,42.12 19.75,41.17 20.81,18.76 13,19.03 47.59,32.62 23.11,2.19 20.72,2.02 19.94,2.72 22.58,2.77 37.81,15.02 37.81,15.85 37.81,16.68 38.63,16.68 49.08,15.02 49.08,15.85 49.08,16.68
  pour Top (isolate 0.25): 0,0 50,0 50,50 0,50
  pour Bottom (isolate 0.25): 0,0 50,0 50,50 0,50
HALL  (via drill 0.31)
  Top 0.254: AVR.24 24.14,34.12 v24.37,33.89 | v19.44,4.13 20.06,3.51 21.83,3.51 | J1.8 21.83,3.51 | R41.2 21.83,3.51
  Bottom 0.254: v24.37,33.89 24.37,33.78 22.45,31.86 22.45,15.68 18.41,11.64 18.41,10.77 19.44,9.74 v19.44,4.13 | R38.1 23.01,3.51 J1.8
LCD_A
  Top 0.254: AVR.14 15.23,37.22 13.49,35.48 3.81,35.48 3.17,34.85 3.17,32.78 3.65,32.31 3.65,29.72 R1.2
LCD_C  (via drill 0.31)
  Top 0.254: AVR.13 15.29,38.02 13.39,36.12 3.33,36.12 2.62,35.4 2.62,32.54 2.94,32.23 v2.94,31.04 | v1.9,21.42 1.9,20.97 2.19,20.68 R8.2
  Bottom 0.254: v1.9,21.42 2.94,22.46 v2.94,31.04
LCD_D  (via drill 0.31)
  Top 0.254: v9.35,39.77 11.11,39.77 13.89,42.55 15.79,42.55 16.46,43.22 16.47,43.22 17.5,44.25 18.3,44.25 18.64,43.91 AVR.7 | v1.53,23.86 1.82,23.57 R5.2
  Bottom 0.254: v9.35,39.77 9.13,39.77 6.75,37.39 6.75,34.61 5.24,33.1 2.06,33.1 1.24,32.27 1.24,24.15 v1.53,23.86
LCD_E  (via drill 0.31)
  Top 0.254: v10.47,39.05 11.27,39.05 14.13,41.91 16.11,41.91 16.91,42.7 AVR.8 | v2.06,25.71 2.76,25.01 R4.2
  Bottom 0.254: v2.06,25.71 2.06,32.31 2.3,32.54 5.56,32.54 7.3,34.29 7.3,37.22 9.13,39.05 v10.47,39.05
LCD_F
  Top 0.254: AVR.12 15.24,38.82 13.1,36.67 3.02,36.67 2.06,35.72 2.06,28.26 2.42,27.9 R2.2
LDO_HS  (via drill 0.31)  (4 unrouted)
  other vias: 4.62,13.79 3.8,13.79 5.45,13.79 6.27,13.79 7.1,13.79
LOETKOLBEN  (via drill 0.31)
  Top 0.254: TPSLDR.TP 21.55,18.33 v21.55,19.4 21.5,19.36 24.11,19.36 24.64,18.82 26.21,18.82 v27.86,17.17 27.58,16.89 R10.2 | AVR.9 15.38,41.22 v15.23,41.07
  Bottom 0.254: R13.2 29.02,17.16 27.87,17.16 v27.86,17.17 | v21.55,19.4 21.91,19.76 21.91,32.1 22.91,33.1 22.91,39.62 22.41,40.12 21.5,40.12 21.13,39.75 16.55,39.75 v15.23,41.07
MISO  (via drill 0.31)
  Top 0.254: v8.02,33.5 12.86,33.5 14.98,35.62 AVR.16 17.91,35.62 18.41,36.12 18.41,36.92 17.62,37.7 v17.62,41.36 | R6.2 1.61,22.12 1.24,21.75 1.24,20.89 2.39,19.73 5.28,19.73 6.15,18.86 7.47,18.86 7.92,19.32 v10.11,19.32
  Bottom 0.254: v8.02,33.5 8.73,32.78 11.51,32.78 11.99,32.3 11.99,21.19 v10.11,19.32 | JP1.1 17.62,41.71 v17.62,41.36
MOSI  (via drill 0.31)
  Top 0.254: v17.57,36.43 17.56,36.42 AVR.15 | v2.7,41.2 1.51,40.01 1.51,27.43 2.48,26.46 R3.2
  Bottom 0.254: JP1.4 12.06,46.67 11.43,46.04 8.89,46.04 8.34,45.48 8.34,44.29 9.08,43.55 | v2.7,41.2 4.05,42.55 8.08,42.55 9.08,43.55 | 9.08,43.55 14.45,38.18 16.59,38.18 17.57,37.2 v17.57,36.43
N$1
  Bottom 0.5: OPA.2 42.74,9.97 43.17,9.54 43.17,7.52 R17.1 R19.2
N$2
  Top 0.254: R12.1 13.96,3.7 LED3.C
N$3  (via drill 0.31)
  Top 0.254: R31.1 31.74,40.04 v37.23,40.04
  Bottom 0.254: R35.2 38.48,41.29 37.97,40.78 37.6,40.78 | LM324.2 34.81,40.78 37.6,40.78 | v37.23,40.04 37.6,40.41 37.6,40.78
N$4
  Bottom 0.254: LM324.13 LM324.12 29.42,39.42 27.27,39.42 | 27.27,39.42 R39.2 27.87,36.83 LM324.10 LM324.9 | R40.1 27.27,41.48 27.27,39.42
N$5
  Bottom 0.5: C4.1 42.35,14.87 L2.2
  Bottom 0.508: OPA.7 44.51,9.97 43.86,10.63 L2.2
N$7  (via drill 0.31)
  Top 0.254: v42.51,42.88 42.88,42.88 TPS1.TP | v35.54,42.76 37.14,42.76 D1.A
  Bottom 0.254: LM324.1 35.43,41.91 35.54,42.02 v35.54,42.76 40.57,42.76 | 40.57,42.76 42.39,42.76 v42.51,42.88 | R35.1 40.67,42.67 40.57,42.76
N$8  (via drill 0.31)
  Top 0.254: R30.1 39.79,39.95 39.75,39.91 | R29.2 40.01,39.91 39.75,39.91 | 39.75,39.91 v38.67,39.91
  Bottom 0.254: LM324.3 36.41,39.37 37.02,38.76 37.52,38.76 v38.67,39.91
N$11  (via drill 0.31)
  Top 0.254: D1.C 41.52,42.8 43.38,40.95 43.38,39.05 42.22,37.89 v42.22,37.68 | TPS2.TP 34.47,35.54 v32.94,35.54 | C16.+ 44.49,34.39 R26.1
  Bottom 0.254: v32.94,35.54 32.96,35.56 LM324.6 36.05,35.56 37.27,36.78 42.31,36.78 | 42.31,36.78 42.53,36.78 C16.+ | v42.22,37.68 42.22,36.86 42.31,36.78
N$12  (via drill 0.31)
  Top 0.254: v46.35,41.15 46.63,40.87 R24.1
  Bottom 0.254: LM324.5 36.13,36.83 36.49,37.19 36.49,37.81 36.69,38.01 41.29,38.01 42.4,39.12 R28.1 42.87,39.77 44.25,41.15 v46.35,41.15
N$14
  Top 0.254: R27.2 43.2,37.06 R25.2 43.28,37.57 44.73,39.01 R24.2
N$15  (via drill 0.31)
  Top 0.254: IRF.4 29.44,6.72 v29.8,6.36
  Bottom 0.254: R14.1 29.8,8.49 v29.8,6.36
N$16  (via drill 0.31)
  Top 0.254: 30.38,13.4 PWR-Q2.3 34.23,13.4 TPPWR.TP | v30.38,12.38 30.38,13.4 | 30.38,13.4 30.38,14.47 R10.1
  Bottom 0.254: 28.3,12.69 PWR-Q1.1 29.04,12.38 v30.38,12.38
N$22
  Bottom 0.254: R23.1 43.92,28.26 R22.2 44.23,29.97 S1.3
N$23
  Bottom 0.254: R21.1 43.41,19.24 S2.4 45.05,19.27 R20.2
N$24
  Top 0.254: R18.2 9.99,3.7 LED2.C
N$25
  Top 0.254: R11.2 17.92,3.7 LED1.C
N$27
  Bottom 0.5: C5.2 39.06,11.14 | 39.06,11.14 R16.2 | OPA.3 39.16,11.24 39.06,11.14
N$31  (via drill 0.31)
  Top 0.254: DIS1.6 30.08,19.92 28.98,18.82 27.2,18.82 26.1,19.92 DIS2.6 24.69,20.31 19.52,20.31 17.95,18.74 15.86,18.74 DIS3.6 | R6.1 5.49,22.12 v6.03,21.59 | 14.62,19.98 DIS3.6 | v9.37,19.98 9.43,19.92 DIS3.6
  Bottom 0.254: v6.03,21.59 6.03,23.48 6.48,23.94 8.63,23.94 10.28,22.29 10.28,20.51 9.74,19.98 v9.37,19.98
N$34
  Top 0.254: DIS1.2 26.75,27.54 25.57,28.73 24.6,28.73 24.27,28.4 18.87,28.4 18.02,27.54 DIS2.2 16.59,27.54 15.24,28.89 14.02,28.89 13.32,28.19 7.71,28.19 DIS3.2 6.7,27.9 R2.1
N$35
  Top 0.254: DIS1.1 26.75,30.08 25.4,31.43 24.58,31.43 23.2,30.05 17.49,30.05 DIS2.1 16.11,31.43 14.29,31.43 12.94,30.08 DIS3.1 6.37,30.08 5.73,30.72 R7.1
N$36
  Top 0.254: 9.49,22.46 DIS3.4 | 9.49,22.46 12.62,22.46 13.97,23.81 16.11,23.81 DIS2.4 18.33,22.46 19.05,23.18 24.13,23.18 24.72,23.77 26.55,23.77 DIS1.4 | 9.49,22.46 9.54,22.5 9.54,23.4 9,23.94 7.1,23.94 6.6,23.94 6.56,23.94 5.49,25.01 R4.1
N$37  (via drill 0.31)
  Top 0.254: DIS1.5 27.41,19.92 26.06,21.27 19.31,21.27 17.96,19.92 DIS2.5 16.19,19.92 14.84,21.27 14.13,21.27 13.49,20.64 7.78,20.64 DIS3.5 | v8.38,23.2 8.05,23.53 5.02,23.53 R5.1
  Bottom 0.254: v8.38,23.2 8.38,21.24 DIS3.5
N$38  (via drill 0.31)
  Top 0.254: DIS1.7 30.08,22.46 28.89,21.27 27.35,21.27 26.16,22.46 DIS2.7 19.41,22.46 18.22,21.27 15.87,21.27 DIS3.7 13.78,22.46 12.68,21.35 v9.37,21.35 6.75,21.35 6.07,20.68 R8.1
N$39
  Top 0.254: DIS1.9 29.76,27.54 28.57,26.35 26.27,26.35 DIS2.9 19.29,27.54 18.1,26.35 15.87,26.35 DIS3.9 8.69,27.54 7.43,26.27 5.16,26.27 R3.1
N$40
  Top 0.254: DIS1.10 29.76,30.08 28.57,28.89 26.7,28.89 25.52,30.08 DIS2.10 24.3,29.3 18.51,29.3 18.1,28.89 16.83,28.89 15.64,30.08 DIS3.10 13.97,30.08 12.74,28.85 6.39,28.85 5.9,29.35 R1.1
OPA_OUT  (via drill 0.31)
  Top 0.508: R33.1 23.11,31.48 v23.11,30.87 | v29.88,20.89 30.25,21.26 40.08,21.26 43.79,17.54 47.59,17.54 48.17,16.96 v48.17,14.16
  Bottom 0.5: 44.62,7.38 R17.2 | 30.67,20.1 TPTEMP.TP | 48.17,7.84 48.17,11.23 46.55,11.23 OPA.6
  Bottom 0.508: v23.11,30.87 23.77,30.21 23.77,29.1 24.06,28.81 29.43,28.81 30.46,27.78 30.46,21.46 v29.88,20.89 30.67,20.1 | v48.17,14.16 48.17,11.23 | 48.17,7.84 47.65,7.32 R17.2
P-FET_GATE
  Bottom 0.254: PWR-Q1.3 31.78,13.64 32.05,13.36 R15.1 R14.2
PC2  (via drill 0.31)
  Top 0.254: 25.38,35.62 AVR.25 26.21,35.62 26.79,36.2 | 26.79,36.2 26.79,38.59 29.26,41.07 37.81,41.07 38.72,41.98 38.72,44.7 39.66,45.65 J2.2 | 26.79,36.2 v27.57,36.2 | R32.2 28.83,34.88 v27.65,34.88
  Bottom 0.254: v27.57,36.2 27.65,36.12 v27.65,34.88
PC3
  Top 0.254: AVR.26 25.98,36.42 26.33,36.78 26.33,38.84 29.8,42.31 33.85,42.31 37.12,45.58 J2.1
PWM_OUT
  Top 0.254: 34.64,11.34 IRF.8 | J1.4 34.55,2.11 33.56,1.11 18.8,1.11 LED1.A
  Top 1.5: IRF.8 IRF.7 IRF.6 IRF.5 34.55,7.37 J1.4 J1.3
RST  (via drill 0.31)
  Top 0.254: AVR.29 v21.77,38.82 | R34.2 8.25,42.3 9.53,43.58 JP1.5
  Bottom 0.254: JP1.5 9.53,44.22 14.92,38.82 v21.77,38.82
RX
  Top 0.254: AVR.30 26.28,39.62 31.57,44.91 UART.2
SAFETY  (via drill 0.31)
  Top 0.254: v32.57,18.86 33.17,18.25 R9.2 33.17,15.68 | PWR-Q2.1 33.17,15.68 | R32.1 31.53,35.03 v31.53,34.3 | 33.17,15.68 34.63,15.68 34.71,15.68 | 34.71,15.68 35.17,15.68 36.94,13.91 36.94,6.11 38.39,4.66 38.39,1.07 37.97,0.66 15.29,0.66 LED3.A | TPS3.TP 34.71,15.68
  Bottom 0.254: v32.57,18.86 32.57,22.21 33.64,23.28 33.64,26.46 32.59,27.5 32.59,31.96 33.04,32.4 36.73,32.4 37.86,33.52 SAFETY.2 SAFETY.1 | v31.53,34.3 31.54,34.29 LM324.7 36.19,34.29 36.49,34.59 36.49,35.17 37.52,36.2 39.95,36.2 40.41,35.74 SAFETY.1 | SAFETY.1 43.25,34.22 44.45,33.02 46.81,33.02 47.71,33.93 47.71,36.42 45.02,39.12 R28.2
SCK  (via drill 0.31)
  Top 0.254: 17.82,34.11 AVR.17 14.76,34.12 12.94,32.31 11.05,32.31 9.38,30.64 8.49,30.64 7.86,31.27 6.04,31.27 R7.2 5,32.52 v5,34.13 | v8.31,41.15 10.2,41.15 12.06,43.02 JP1.3
  Bottom 0.254: v5,34.13 5,37.84 v8.31,41.15
SCL  (via drill 0.31)
  Top 0.254: AVR.28 21.67,38.02 20,39.69 v20,40.36 | I2C.3 23.48,47.64 22,49.12 13.77,49.12 13.64,48.99 R37.1
  Bottom 0.254: v20,40.36 20,40.56 21.67,42.23 22.86,42.23 23.48,42.84 I2C.3
SDA  (via drill 0.31)
  Top 0.254: AVR.27 21.52,37.22 19.05,39.69 v19.05,40.37 | I2C.2 18.95,48.09 17.77,48.09 R36.1
  Bottom 0.254: v19.05,40.37 19.05,42.53 20.94,44.42 I2C.2
SENSOR0
  Bottom 0.5: R16.1 38.63,8.48 38.63,5.37 39.63,4.37 J1.2
THERMO0
  Top 0.254: 26.04,34.85 24.14,34.85 23.73,35.25 22.79,35.25 22.64,35.1 AVR.23 | 26.04,34.85 26.04,33.98 26.14,33.88 C10.1 | 26.04,34.85 26.34,34.85 26.99,35.5 27.86,35.5 28.81,36.45 28.81,38.8 R31.2
  Top 0.508: R33.2 22.64,32.7 AVR.23
TX
  Top 0.254: AVR.31 26.13,40.42 29.03,43.32 UART.1
VCC  (via drill 0.31, 0.4)
  Top 0.254: v47.31,31.43 47.31,31.59 | v16.8,48.09 15.38,48.09 14.61,47.31 JP1.2 | R34.1 7.33,45.71 7.66,46.04 13.34,46.04 14.56,47.27 JP1.2 | LED2.A 10.34,1.8 v11.27,0.87 | R36.2 17.5,45.21 I2C.1 | C12.1 9.87,48.91 R37.2 12.09,48.91 13.74,47.27 JP1.2
  Top 0.457: R27.1 R29.1
  Top 0.5: 47.31,31.59 46.83,32.07 | C6.2 46.01,15.4
  Top 0.508: v21.27,40.96 21.04,41.19 AVR.4 21.04,43.68 20.66,44.06 19.44,44.06 | 46.83,32.07 39.13,32.07 | 39.13,32.07 37.27,32.07 36.86,31.66 v29.72,31.66 | v18.57,38.02 18.26,38.34 18.26,41 18.61,41.36 18.9,41.36 19.44,41.89 AVR.6 19.44,44.06 | J1.1 42.17,4.53 42.76,5.12 42.76,9.31 45.88,12.43 C6.2 | 46.01,15.4 v47.34,15.4 | v17.56,13.35 17.1,13.81 LDO.2 | 39.13,32.07 39.13,36.73 R27.1 35.24,37.06 C9.1 34.92,37.85 34.26,38.51 v32.48,38.51 | 19.44,44.06 19.44,45.06 I2C.1 | v17.56,13.35 19.15,11.76 v19.15,11.23 | v17.56,13.35 18.27,14.06 C2.2
  Top 0.8: LDO.2 13.72,13.81 11.19,16.34 C13.+
  Bottom 0.254: R22.1 47.91,26.6 R20.1 | L2.1 46.78,15.4 | I2C.1 18.4,47.85 18.16,48.09 v16.8,48.09 | R39.1 25.48,37.35 24.52,37.35 | 22.04,2.06 20.68,0.7 11.43,0.7 v11.27,0.87 | R38.2 21.85,5.74 20.27,5.74
  Bottom 0.5: R22.1 45.94,29.14 47.31,30.52 v47.31,31.43 | L1.2 19.85,28.5 | 26.42,33.14 26.42,33.64 24.52,35.54 24.52,37.35 24.52,39.25 22.81,40.96 v21.27,40.96
  Bottom 0.508: L1.2 16.76,28.64 16.06,29.35 16.06,33.91 17.22,35.08 17.94,35.08 18.57,35.72 v18.57,38.02 | 26.42,33.14 27.9,31.66 v29.72,31.66 | J1.1 42.17,2.26 40.78,0.87 23.24,0.87 22.04,2.06 20.27,3.84 20.27,5.74 20.27,10.11 v19.15,11.23 | 46.78,15.4 v47.34,15.4 | 19.85,28.5 19.85,15.64 v17.56,13.35 | v32.48,38.51 32.89,38.1 LM324.4
(copper drawn outside any net)
  shapes: Bottom area x1, Top area x1

### Text on the board
tNames: 5V-DA-CL-G | TX-RX-G | C3-C2-G | G-G-12-12 | 01.10.2015 / v1.3 | H-G-G-G-12-12-S-5
bNames: 1